# EAGLE schematic EX Analog (EAGLE 7.2.0)
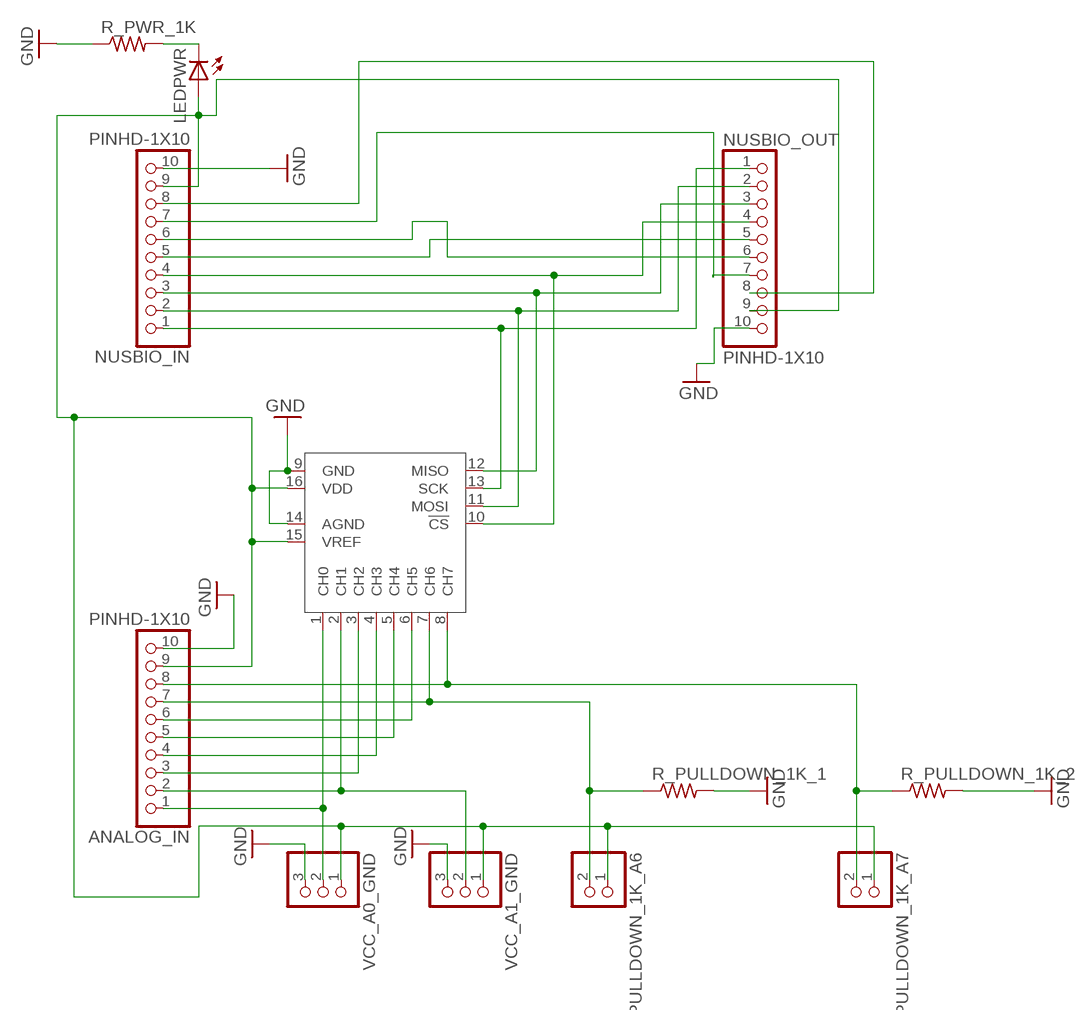
[diagram p0: schematic, sheet 1]

## Parts
ANALOG_IN  PINHD-1X10  [1X10-BIG]
LEDPWR  LEDCHIPLED_0805  [CHIPLED_0805]
NUSBIO_IN  PINHD-1X10  [1X10-BIG]
NUSBIO_OUT  PINHD-1X10  [1X10-BIG]
PULLDOWN_1K_A6  PINHD-1X2  [1X02]
PULLDOWN_1K_A7  PINHD-1X2  [1X02]
R_PULLDOWN_1K_1  R-US_R0805  [R0805]
R_PULLDOWN_1K_2  R-US_R0805  [R0805]
R_PWR_1K  R-US_R0805  [R0805]
U$1  MCP3008SL  [SO16]
VCC_A0_GND  PINHD-1X3  [1X03]
VCC_A1_GND  PINHD-1X3  [1X03]

## Nets
GND: ANALOG_IN.10 NUSBIO_IN.10 NUSBIO_OUT.10 R_PULLDOWN_1K_1.2 R_PULLDOWN_1K_2.2 R_PWR_1K.1 U$1.9(GND) U$1.14(AGND) VCC_A0_GND.3 VCC_A1_GND.3
N$1: NUSBIO_IN.1 NUSBIO_OUT.1 U$1.13(SCK)
N$2: NUSBIO_IN.2 NUSBIO_OUT.2 U$1.11(MOSI)
N$3: NUSBIO_IN.3 NUSBIO_OUT.3 U$1.12(MISO)
N$4: NUSBIO_IN.5 NUSBIO_OUT.5
N$5: NUSBIO_IN.4 NUSBIO_OUT.4 U$1.10(!CS)
N$6: LEDPWR.C R_PWR_1K.2
N$7: NUSBIO_IN.6 NUSBIO_OUT.6
N$8: NUSBIO_IN.7 NUSBIO_OUT.7
N$9: NUSBIO_IN.8 NUSBIO_OUT.8
N$10: ANALOG_IN.1 U$1.1(CH0) VCC_A0_GND.2
N$11: ANALOG_IN.2 U$1.2(CH1) VCC_A1_GND.2
N$12: ANALOG_IN.3 U$1.3(CH2)
N$13: ANALOG_IN.4 U$1.4(CH3)
N$14: ANALOG_IN.6 U$1.6(CH5)
N$15: ANALOG_IN.7 PULLDOWN_1K_A6.2 R_PULLDOWN_1K_1.1 U$1.7(CH6)
N$16: ANALOG_IN.8 PULLDOWN_1K_A7.2 R_PULLDOWN_1K_2.1 U$1.8(CH7)
N$17: ANALOG_IN.5 U$1.5(CH4)
N$18: ANALOG_IN.9 LEDPWR.A NUSBIO_IN.9 NUSBIO_OUT.9 PULLDOWN_1K_A6.1 PULLDOWN_1K_A7.1 U$1.15(VREF) U$1.16(VDD) VCC_A0_GND.1 VCC_A1_GND.1

## Library data of the parts
ANALOG_IN NUSBIO_IN NUSBIO_OUT = adafruit:PINHD-1X10: Pin header 1x10 0.1" spacing With round pins
LEDPWR = adafruit:LED: LED OSRAM: - CHIPLED LG R971, LG N971, LY N971, LG Q971, LY Q971, LO R971, LY R971 LH N974, LH R974 LS Q976, LO Q976, LY Q976 LO Q996 - Hyper CHIPLED LW Q18S LB Q993, LB Q99A, LB R99A - SideLED LS A670, LO A670, LY A670, LG A670, LP A670 LB A673, LV A673, LT A673, LW A673 LH A674 LY A675 LS A676, LA A676, LO A676, LY A676, LW A676 LS A679, LY A679, LG A679 - Hyper Micro SIDELED® LS Y876, LA Y876, LO Y876, LY Y876 LT Y87S - SmartLED LW L88C, LW L88S LB L89C, LB L89S, LG L890 LS L89K, LO L89K, LY L89K LS L896, LA L896, LO L896, LY L896 - TOPLED LS T670, LO T670, LY T670, LG T670, LP T670 LSG T670, LSP T670, LSY T670, LOP T670, LYG T670 LG T671, LOG T671, LSG T671 LB T673, LV T673, LT T673, LW T673 LH T674 LS T676, LA T676, LO T676, LY T676, LB T676, LH T676, LSB T676, LW T676 LB T67C, LV T67C, LT T67C, LS T67K, LO T67K, LY T67K, LW E67C LS E67B, LA E67B, LO E67B, LY E67B, LB E67C, LV E67C, LT E67C LW T67C LS T679, LY T679, LG T679 LS T770, LO T770, LY T770, LG T770, LP T770 LB T773, LV T773, LT T773, LW T773 LH T774 LS E675, LA E675, LY E675, LS T675 LS T776, LA T776, LO T776, LY T776, LB T776 LHGB T686 LT T68C, LB T68C - Hyper Mini TOPLED® LB M676 - Mini TOPLED Santana® LG M470 LS M47K, LO M47K, LY M47K Source: http://www.osram.convergy.de/
PULLDOWN_1K_A6 PULLDOWN_1K_A7 = pinhead:PINHD-1X2: PIN HEADER
R_PULLDOWN_1K_1 R_PULLDOWN_1K_2 R_PWR_1K = adafruit:R-US_: RESISTOR, American symbol
U$1 = MCP3008:MCP3008
VCC_A0_GND VCC_A1_GND = adafruit:PINHD-1X3: PIN HEADER